# EAGLE design SoundPiezoModule (EAGLE 5.10)
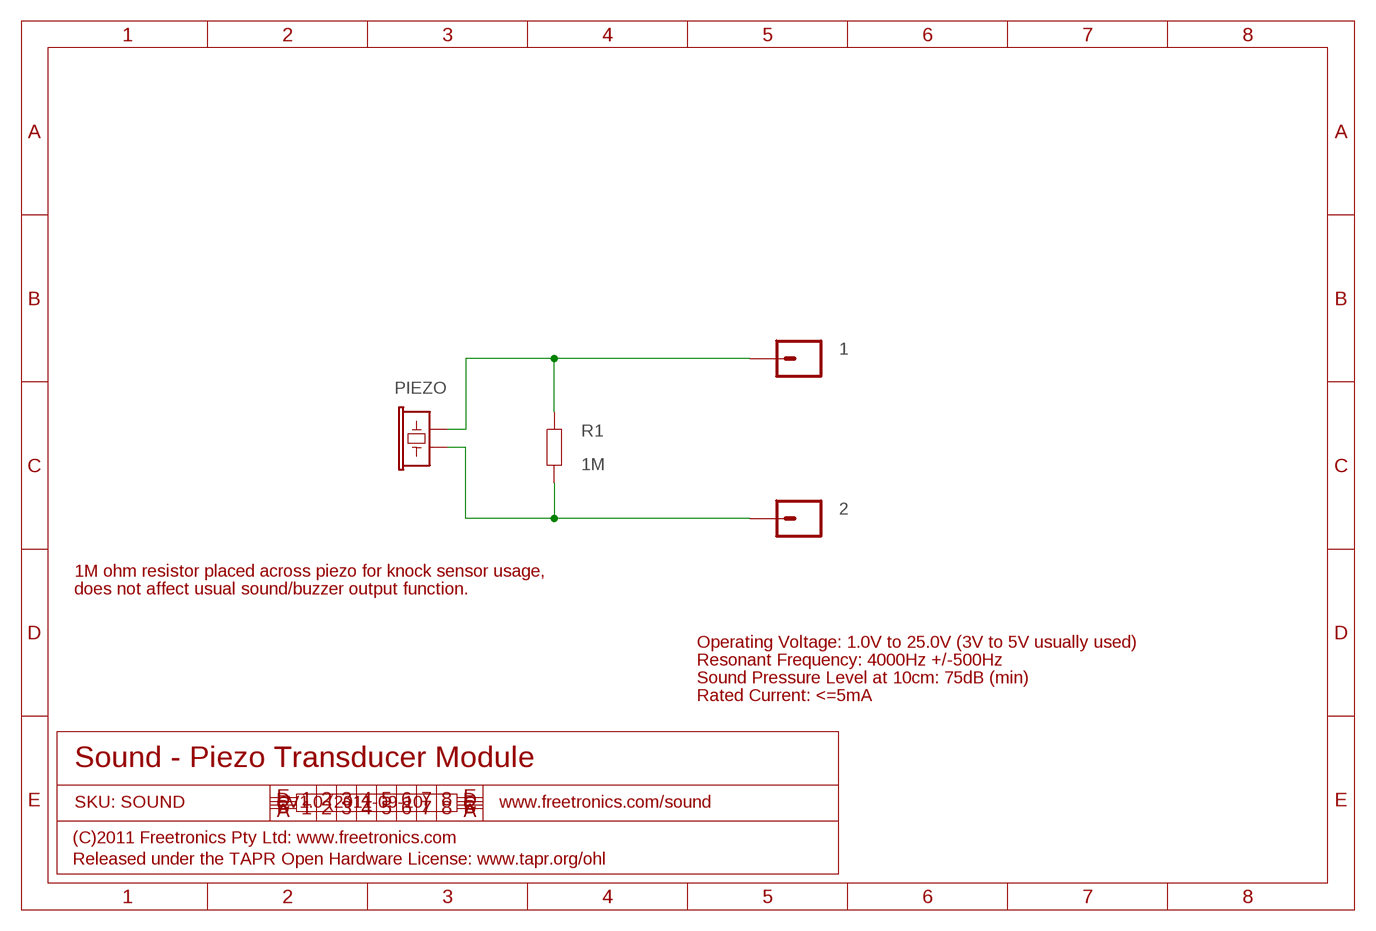
[diagram p0: schematic, sheet 1]

## Parts
1  M01PTH  [1X01]
2  M01PTH  [1X01]
PIEZO  BUZZERSMD12X12  [BUZZER-12X12-SMT]
R1  1M  RESISTOR0603  [0603]

## Nets
N$1: 1.1 PIEZO.2 R1.2
N$2: 2.1 PIEZO.1 R1.1

## Notes on the sheet
- 1M ohm resistor placed across piezo for knock sensor usage,
- does not affect usual sound/buzzer output function.
- Operating Voltage: 1.0V to 25.0V (3V to 5V usually used)
- Resonant Frequency: 4000Hz +/-500Hz
- Sound Pressure Level at 10cm: 75dB (min)
- Rated Current: <=5mA
- Sound - Piezo Transducer Module
- SKU: SOUND | V1.0 (2011-09-10) | www.freetronics.com/sound
- (C)2011 Freetronics Pty Ltd: www.freetronics.com
- Released under the TAPR Open Hardware License: www.tapr.org/ohl

## Library data of the parts
1 2 = freetronics-master-v1:M01: Header 1 Standard 1-pin 0.1" header. Use with straight break away headers (SKU : PRT-00116), right angle break away headers (PRT-00553), swiss pins (PRT-00743), machine pins (PRT-00117), and female headers (PRT-00115).
PIEZO = freetronics-master-v1:BUZZER: Buzzer - Piezo Transducer
R1 = freetronics-master-v1:RESISTOR: Resistor Basic schematic elements and footprints for 0603, 1206, and PTH 1/10th watt (small) resistors.

## Board
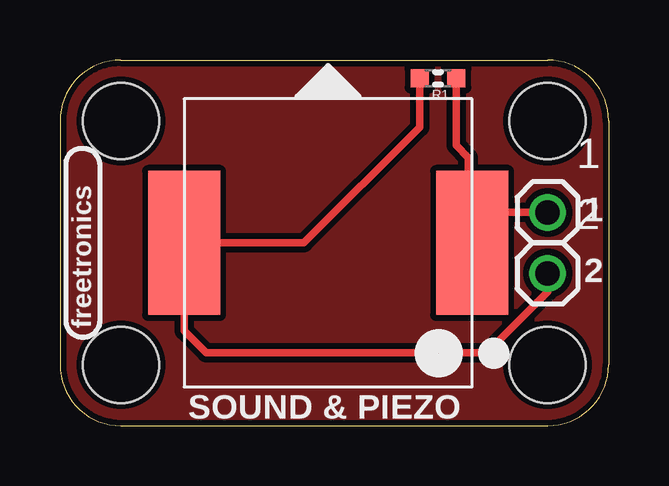
[diagram p1: board, top side]
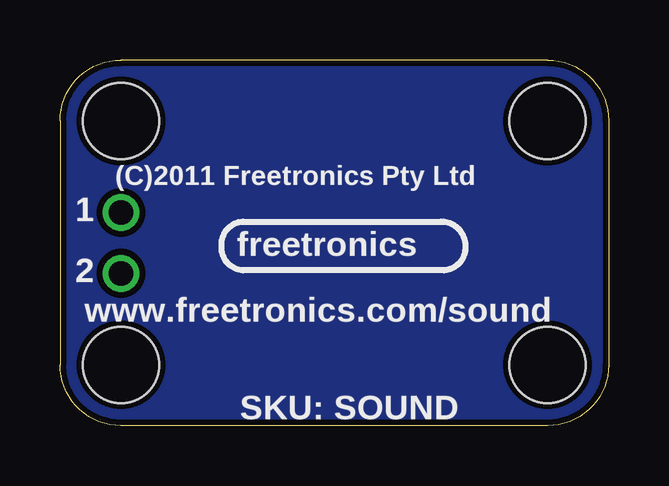
[diagram p2: board, bottom side, seen from below]

Size 22.86 x 15.24 mm. Coordinates in mm from the lower left corner, seen from the top.
Outline: 0,2.54 arc90 2.54,0 20.32,0 arc90 22.86,2.54 22.86,12.7 arc90 20.32,15.24 2.54,15.24 arc90 0,12.7 0,2.54
Copper layers (1*16): Top 0.035mm / dielectric 1.5mm / Bottom 0.035mm
Design rules "default *": minimum track width 8mil, minimum drill 15mil, track to track 10mil, track to pad 10mil, pad to pad 10mil, via to via 10mil, smd to smd 8mil, copper to edge 10mil, drill to drill 8mil, minimum pad ring 10mil, minimum via ring 8mil, stop-mask expansion 4mil, vias tented up to drill 25mil, thermal gap 10mil
Holes 3.17 mm at 2.54,2.54 20.32,2.54 2.54,12.7 20.32,12.7

### Footprints (pad centres in the part's own frame; a part is rotated, then mirrored left to right if it is on the bottom)
1X01 = drill 1.016 round: 1 0,0
BUZZER-12X12-SMT = smd 3 x 6: 1 -6,0; 2 6,0
0603 = smd 0.762 x 0.762: 1 -0.762,0; 2 0.762,0

### Placement (x,y rotation side)
1  20.32,8.89 0 top
2  20.32,6.35 0 top
PIEZO  11.18,7.62 0 top
R1  15.75,14.48 0 top

### Tracks (layer width: path | path; a pad name or v marks a point on that pad's centre or on a via)
GND
  pour Top: 2.54,15.24 20.45,15.24 arc-90 22.86,12.7 22.86,2.67 arc-90 20.32,0 2.41,0 arc-90 0,2.54 0,12.57 arc-90
  pour Bottom: 2.54,15.24 20.45,15.24 arc-90 22.86,12.7 22.86,2.67 arc-90 20.32,0 2.41,0 arc-90 0,2.54 0,12.57 arc-90
N$1
  Top 0.305: 1.1 18.45,8.89 PIEZO.2 17.02,7.78 17.02,11.18 16.51,11.68 R1.2
N$2
  Top 0.305: 2.1 20.32,5.59 17.78,3.05 6.1,3.05 5.18,3.97 PIEZO.1 10.16,7.62 14.99,12.45 R1.1

### Text on the board
tPlace: 1 | 2 | freetronics | SOUND & PIEZO
bPlace: (C)2011 Freetronics Pty Ltd | 1 | freetronics | 2 | www.freetronics.com/sound | SKU: SOUND